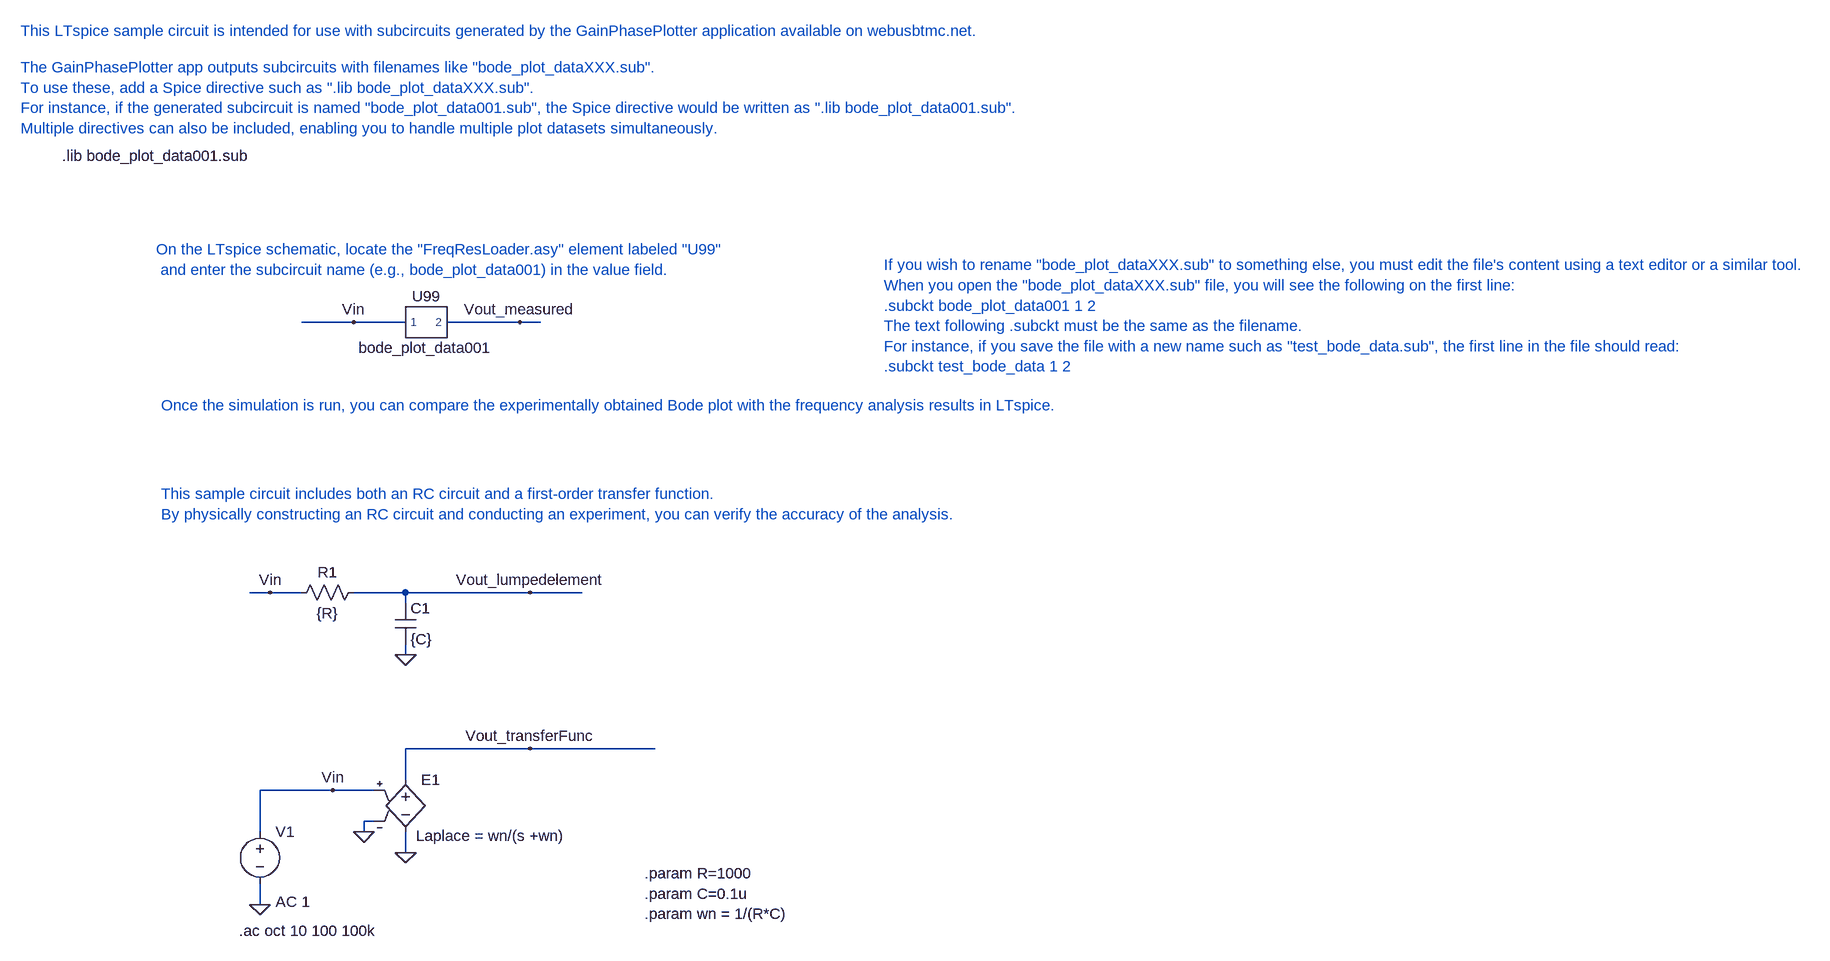
[diagram p0: schematic rc_circuits_fra.asc]
rc_circuits_fra.asc, the LTspice schematic file:
Version 4
SHEET 1 3532 680
WIRE 176 -448 96 -448
WIRE 256 -448 176 -448
WIRE 432 -448 320 -448
WIRE 464 -448 432 -448
WIRE 48 -32 16 -32
WIRE 96 -32 48 -32
WIRE 256 -32 176 -32
WIRE 448 -32 256 -32
WIRE 528 -32 448 -32
WIRE 256 -16 256 -32
WIRE 256 64 256 48
WIRE 448 208 256 208
WIRE 640 208 448 208
WIRE 256 256 256 208
WIRE 144 272 32 272
WIRE 208 272 144 272
WIRE 208 320 192 320
WIRE 32 336 32 272
WIRE 192 336 192 320
WIRE 256 368 256 336
WIRE 32 448 32 416
FLAG 32 448 0
FLAG 144 272 Vin
FLAG 192 336 0
FLAG 256 368 0
FLAG 448 208 Vout_transferFunc
FLAG 256 64 0
FLAG 48 -32 Vin
FLAG 448 -32 Vout_lumpedelement
FLAG 176 -448 Vin
FLAG 432 -448 Vout_measured
SYMBOL voltage 32 320 R0
WINDOW 123 24 124 Left 2
WINDOW 39 0 0 Left 2
SYMATTR Value2 AC 1
SYMATTR InstName V1
SYMATTR Value ""
SYMBOL e 256 240 R0
WINDOW 3 16 102 Left 2
SYMATTR Value Laplace = wn/(s +wn)
SYMATTR InstName E1
SYMBOL res 192 -48 R90
WINDOW 0 0 56 VBottom 2
WINDOW 3 32 56 VTop 2
SYMATTR InstName R1
SYMATTR Value {R}
SYMBOL cap 240 -16 R0
SYMATTR InstName C1
SYMATTR Value {C}
SYMBOL FreqResLoader 288 -448 R0
SYMATTR InstName U99
SYMATTR Value bode_plot_data001
TEXT 0 488 Left 2 !.ac oct 10 100 100k
TEXT 624 400 Left 2 !.param R=1000\n.param C=0.1u\n.param wn = 1/(R*C)
TEXT -272 -704 Left 2 !.lib bode_plot_data001.sub
TEXT -336 -896 Left 2 ;This LTspice sample circuit is intended for use with subcircuits generated by the GainPhasePlotter application available on webusbtmc.net.
TEXT -336 -840 Left 2 ;The GainPhasePlotter app outputs subcircuits with filenames like "bode_plot_dataXXX.sub". \nTo use these, add a Spice directive such as ".lib bode_plot_dataXXX.sub".\nFor instance, if the generated subcircuit is named "bode_plot_data001.sub", the Spice directive would be written as ".lib bode_plot_data001.sub". \nMultiple directives can also be included, enabling you to handle multiple plot datasets simultaneously.
TEXT -128 -560 Left 2 ;On the LTspice schematic, locate the "FreqResLoader.asy" element labeled "U99"\n and enter the subcircuit name (e.g., bode_plot_data001) in the value field.
TEXT -120 -320 Left 2 ;Once the simulation is run, you can compare the experimentally obtained Bode plot with the frequency analysis results in LTspice.
TEXT -120 -184 Left 2 ;This sample circuit includes both an RC circuit and a first-order transfer function. \nBy physically constructing an RC circuit and conducting an experiment, you can verify the accuracy of the analysis.
TEXT 992 -536 Left 2 ;If you wish to rename "bode_plot_dataXXX.sub" to something else, you must edit the file's content using a text editor or a similar tool.\nWhen you open the "bode_plot_dataXXX.sub" file, you will see the following on the first line:\n.subckt bode_plot_data001 1 2\nThe text following .subckt must be the same as the filename.\nFor instance, if you save the file with a new name such as "test_bode_data.sub", the first line in the file should read:\n.subckt test_bode_data 1 2

The netlist it stands for:
* rc_circuits_fra.asc
V1 Vin 0 AC 1
E1 Vout_transferFunc 0 Vin 0 Laplace = wn/(s +wn)
R1 Vout_lumpedelement Vin {R}
C1 Vout_lumpedelement 0 {C}
XU99 Vin Vout_measured bode_plot_data001  ; pins 1 2
.ac oct 10 100 100k
.param R=1000
.param C=0.1u
.param wn = 1/(R*C)
.lib bode_plot_data001.sub
* This LTspice sample circuit is intended for use with subcircuits generated by the GainPhasePlotter application available on webusbtmc.net.
* The GainPhasePlotter app outputs subcircuits with filenames like "bode_plot_dataXXX.sub".
* To use these, add a Spice directive such as ".lib bode_plot_dataXXX.sub".
* For instance, if the generated subcircuit is named "bode_plot_data001.sub", the Spice directive would be written as ".lib bode_plot_data001.sub".
* Multiple directives can also be included, enabling you to handle multiple plot datasets simultaneously.
* On the LTspice schematic, locate the "FreqResLoader.asy" element labeled "U99"
*  and enter the subcircuit name (e.g., bode_plot_data001) in the value field.
* Once the simulation is run, you can compare the experimentally obtained Bode plot with the frequency analysis results in LTspice.
* This sample circuit includes both an RC circuit and a first-order transfer function.
* By physically constructing an RC circuit and conducting an experiment, you can verify the accuracy of the analysis.
* If you wish to rename "bode_plot_dataXXX.sub" to something else, you must edit the file's content using a text editor or a similar tool.
* When you open the "bode_plot_dataXXX.sub" file, you will see the following on the first line:
* .subckt bode_plot_data001 1 2
* The text following .subckt must be the same as the filename.
* For instance, if you save the file with a new name such as "test_bode_data.sub", the first line in the file should read:
* .subckt test_bode_data 1 2
.backanno
.end